# Altium project Roberto_shield.PrjPCB
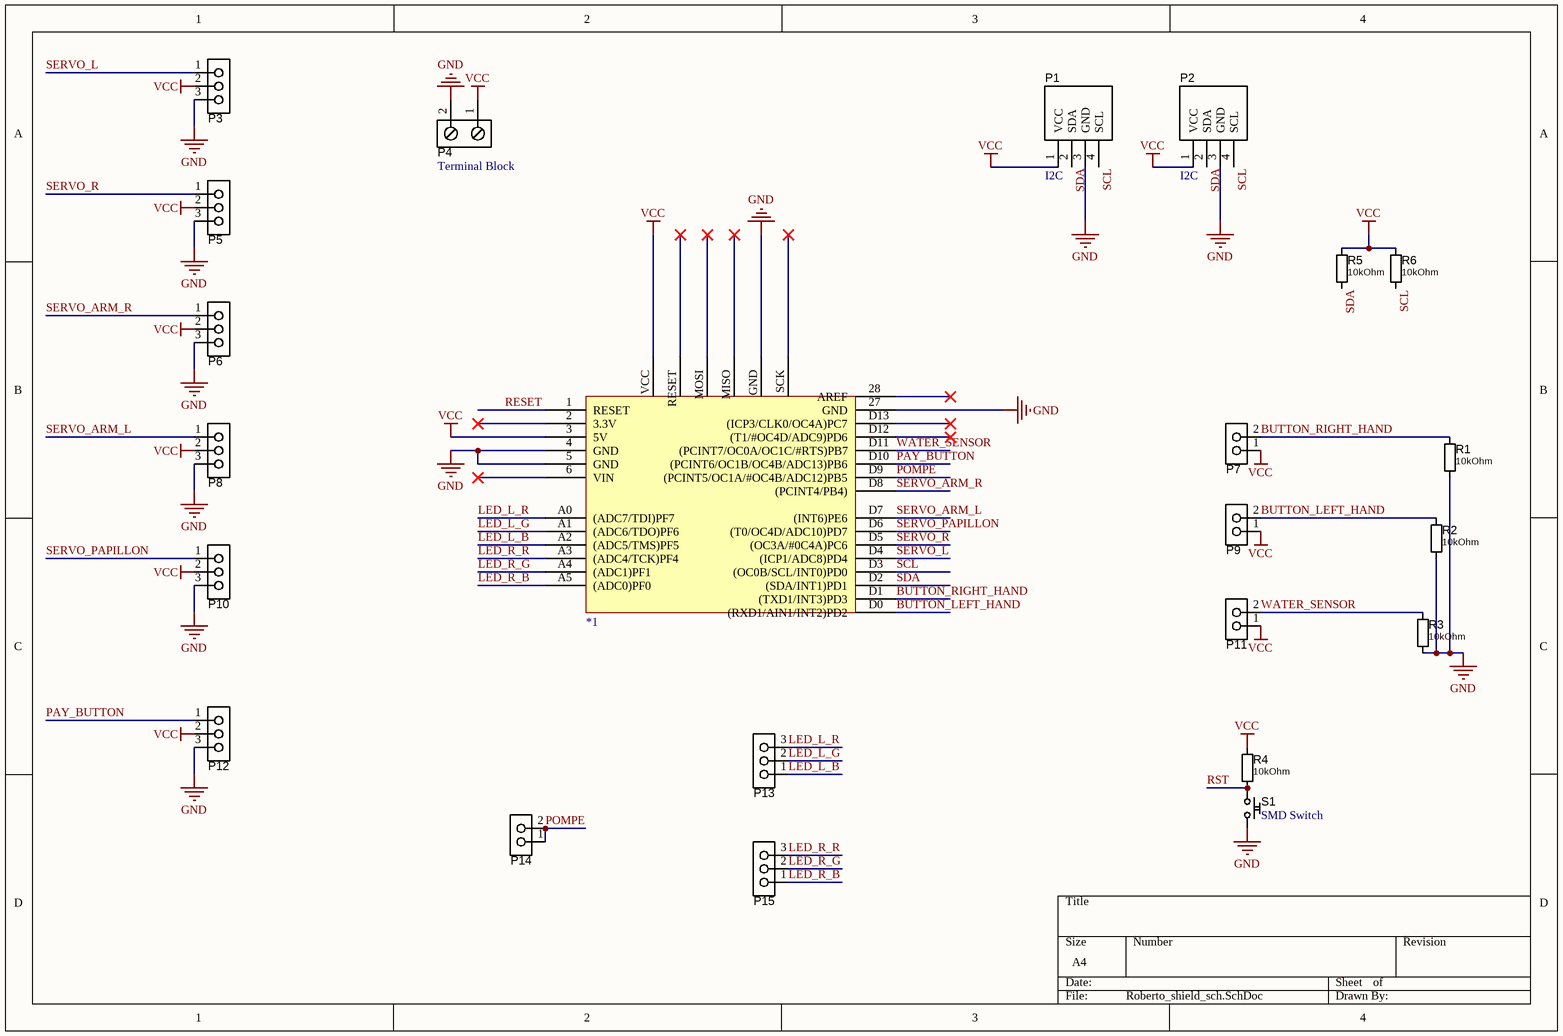
[diagram p0: Roberto_shield_sch.SchDoc]
1 sheet, 23 parts. Net scope: global (net labels, ports and power ports of the same name join across sheets).
Board file: Roverto_shield_PCB.PcbDoc

## Sheet Roberto_shield_sch.SchDoc
size A4

### Parts
*1  Leonardo pins with ISP  [Leonardo pins with ISP]  (value not drawn)
P1  I2C  [TYCO/215079-4]
P2  I2C  [TYCO/215079-4]
P3  Header 3  [HEADER1x3]  (value not drawn)
P4  Terminal Block  [Phoenix PT 2-Pole]
P5  Header 3  [HEADER1x3]  (value not drawn)
P6  Header 3  [HEADER1x3]  (value not drawn)
P7  Header 2  [HEADER1x2]  (value not drawn)
P8  Header 3  [HEADER1x3]  (value not drawn)
P9  Header 2  [HEADER1x2]  (value not drawn)
P10  Header 3  [HEADER1x3]  (value not drawn)
P11  Header 2  [HEADER1x2]  (value not drawn)
P12  Header 3  [HEADER1x3]  (value not drawn)
P13  Header 3  [HEADER1x3]  (value not drawn)
P14  Header 2  [HEADER1x2]  (value not drawn)
P15  Header 3  [HEADER1x3]  (value not drawn)
R1  10kOhm  [R/0805]
R2  10kOhm  [R/0805]
R3  10kOhm  [R/0805]
R4  10kOhm  [R/0805]
R5  10kOhm  [R/0805]
R6  10kOhm  [R/0805]
S1  SMD Switch  [SMD_SW_Red]

### Nets
GND: *1.4(GND) *1.5(GND) *1.27(GND) P1.3(GND) P2.3(GND) P3.3 P4.2 P5.3 P6.3 P8.3 P10.3 P12.3 R1.1 R2.1 R3.1 S1.2
VCC: *1.3(5V) P1.1(VCC) P2.1(VCC) P3.2 P4.1 P5.2 P6.2 P7.1 P8.2 P9.1 P10.2 P11.1 P12.2 R4.2 R5.2 R6.2
BUTTON_LEFT_HAND: *1.D0((RXD1/AIN1/INT2)PD2) P9.2 R2.2
BUTTON_RIGHT_HAND: *1.D1((TXD1/INT3)PD3) P7.2 R1.2
LED_L_B: *1.A2((ADC5/TMS)PF5) P13.1
LED_L_G: *1.A1((ADC6/TDO)PF6) P13.2
LED_L_R: *1.A0((ADC7/TDI)PF7) P13.3
LED_R_B: *1.A5((ADC0)PF0) P15.1
LED_R_G: *1.A4((ADC1)PF1) P15.2
LED_R_R: *1.A3((ADC4/TCK)PF4) P15.3
PAY_BUTTON: *1.D10((PCINT6/OC1B/OC4B/ADC13)PB6) P12.1
POMPE: *1.D9((PCINT5/OC1A/#OC4B/ADC12)PB5) P14.1 P14.2
RESET: *1.1(RESET)
RST: R4.1 S1.1
SCL: *1.D3((OC0B/SCL/INT0)PD0) P1.4(SCL) P2.4(SCL) R6.1
SDA: *1.D2((SDA/INT1)PD1) P1.2(SDA) P2.2(SDA) R5.1
SERVO_ARM_L: *1.D7((INT6)PE6) P8.1
SERVO_ARM_R: *1.D8((PCINT4/PB4)) P6.1
SERVO_L: *1.D4((ICP1/ADC8)PD4) P3.1
SERVO_PAPILLON: *1.D6((T0/OC4D/ADC10)PD7) P10.1
SERVO_R: *1.D5((OC3A/#0C4A)PC6) P5.1
WATER_SENSOR: *1.D11((PCINT7/OC0A/OC1C/#RTS)PB7) P11.2 R3.2

Not connected (* = marked no-connect by the designer): *1 2(3.3V)* 6(VIN)* 28(AREF)* D12((T1/#OC4D/ADC9)PD6)* D13((ICP3/CLK0/OC4A)PC7)* GND(D18) MISO(D17) MOSI(D16) RESET(D15) SCK(D19) VCC(D14)

### Library data of the parts
P1 P2 = Micromatch-I2C: Micromatch I2C Connector
P3 P5 P6 P8 P10 P12 P13 P15 = Header 3: Header, 3-Pin; LatestRevisionDate: 17-Jul-2002; LatestRevisionNote: Re-released for DXP Platform.; Publisher: Altium Limited
P4 = Screw Block 2: 2-Pin Screw Terminal; LatestRevisionDate: 17-Jul-2002; LatestRevisionNote: Re-released for DXP Platform.; Publisher: Altium Limited
P7 P9 P11 P14 = Header 2: Header, 2-Pin; LatestRevisionDate: 17-Jul-2002; LatestRevisionNote: Re-released for DXP Platform.; Publisher: Altium Limited
R1-R6 = R: Resistor; Published: 8-Jun-2000; LatestRevisionDate: 17-Jul-2002; LatestRevisionNote: Re-released for DXP Platform.; PackageReference: AXIAL-0.4; Publisher: Altium Limited; Value: 10kOhm
S1 = SMD Switch: Switch; Published: 24-Mar-1999; LatestRevisionDate: 17-Jul-2002; LatestRevisionNote: Re-released for DXP Platform.; PackageReference: SPST-2; Publisher: Altium Limited